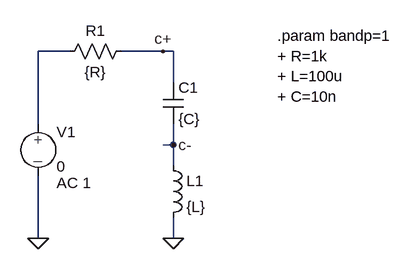
[diagram p0: schematic rlc_stoch.asc]
rlc_stoch.asc, the LTspice schematic file:
Version 4
SHEET 1 880 680
WIRE 64 160 16 160
WIRE 208 160 144 160
WIRE 224 160 208 160
WIRE 224 208 224 160
WIRE 16 272 16 160
WIRE 224 304 224 272
WIRE 224 304 208 304
WIRE 224 336 224 304
WIRE 16 448 16 352
WIRE 16 448 0 448
WIRE 224 448 224 416
FLAG 224 448 0
FLAG 16 448 0
FLAG 208 160 c+
FLAG 224 304 c-
SYMBOL res 48 176 R270
WINDOW 0 32 56 VTop 2
WINDOW 3 0 56 VBottom 2
SYMATTR InstName R1
SYMATTR Value {R}
SYMBOL ind 208 320 R0
SYMATTR InstName L1
SYMATTR Value {L}
SYMBOL cap 208 208 R0
SYMATTR InstName C1
SYMATTR Value {C}
SYMBOL MDB_sym\\source-V 16 256 R0
WINDOW 123 28 107 Left 2
WINDOW 39 0 0 Left 2
SYMATTR InstName V1
SYMATTR Value 0
SYMATTR Value2 AC 1
TEXT 384 136 Left 2 !.param bandp=1\n+ R=1k\n+ L=100u\n+ C=10n

The netlist it stands for:
* rlc_stoch.asc
R1 N001 c+ {R}
L1 c- 0 {L}
C1 c+ c- {C}
V1 N001 0 0 AC 1
.param bandp=1
+ R=1k
+ L=100u
+ C=10n
.backanno
.end